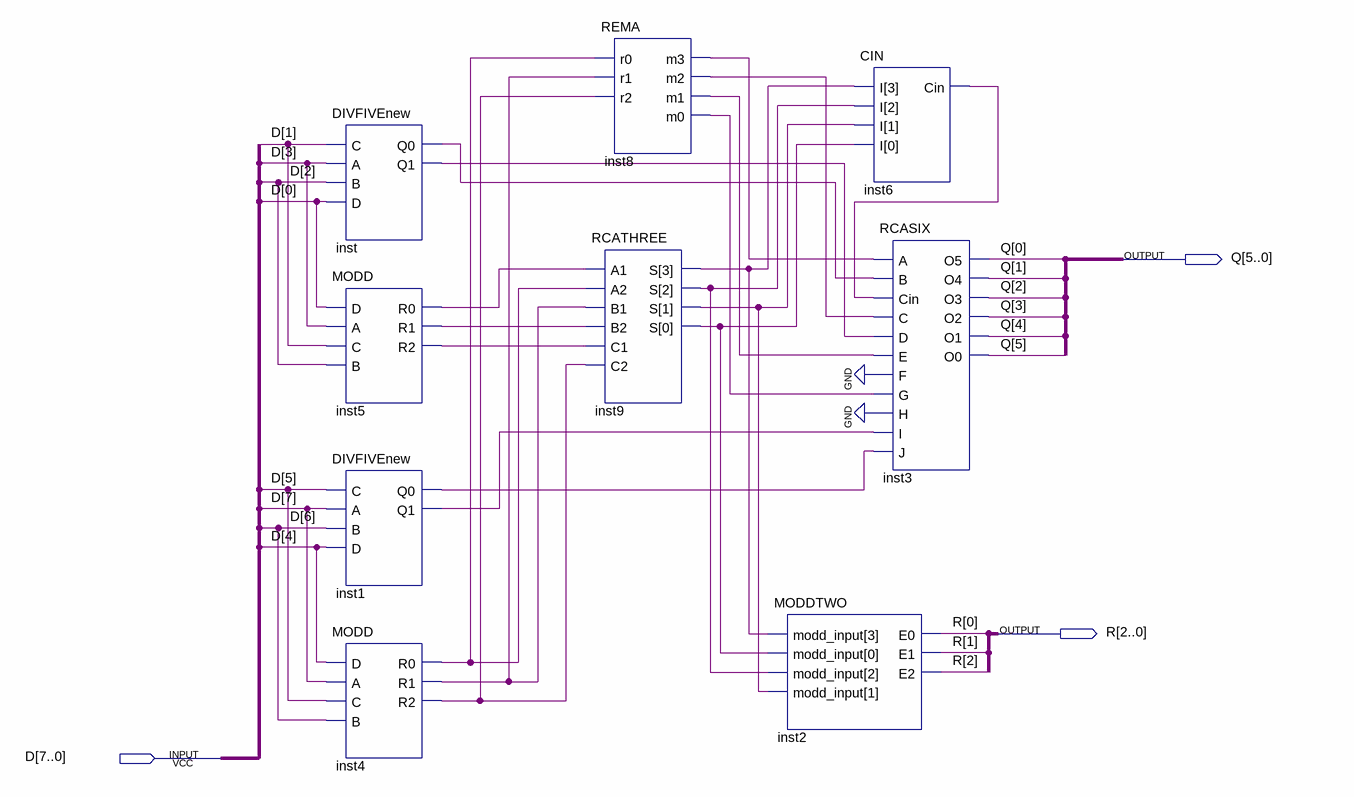
[diagram p0: schematic sheet]
// Quartus schematic EightBitDIV.bdf as structural Verilog: 9 symbols, 3 pins
module EightBitDIV (
  input  [7:0] D,
  output [5:0] Q,
  output [2:0] R
);

  wire inst1_q0, inst1_q1, inst4_r0, inst4_r1, inst4_r2, inst5_r0, inst5_r1, inst5_r2, inst6_cin, inst8_m0,
       inst8_m1, inst8_m2, inst8_m3, inst9_s, inst9_s_2, inst9_s_3, inst9_s_4, inst_q0, inst_q1;

  DIVFIVEnew inst (.C(D[1]), .A(D[3]), .B(D[2]), .D(D[0]), .Q0(inst_q0), .Q1(inst_q1));
  MODD inst5 (.D(D[0]), .A(D[3]), .C(D[1]), .B(D[2]), .R0(inst5_r0), .R1(inst5_r1), .R2(inst5_r2));
  DIVFIVEnew inst1 (.C(D[5]), .A(D[7]), .B(D[6]), .D(D[4]), .Q0(inst1_q0), .Q1(inst1_q1));
  MODD inst4 (.D(D[4]), .A(D[7]), .C(D[5]), .B(D[6]), .R0(inst4_r0), .R1(inst4_r1), .R2(inst4_r2));
  REMA inst8 (.r0(inst4_r0), .r1(inst4_r1), .r2(inst4_r2), .m3(inst8_m3), .m2(inst8_m2), .m1(inst8_m1), .m0(inst8_m0));
  RCATHREE inst9 (
    .A1(inst5_r0), .A2(inst4_r0), .B1(inst4_r1), .B2(inst5_r1), .C1(inst5_r2), .C2(inst4_r2),
    .S({inst9_s, inst9_s_3, inst9_s_4, inst9_s_2}));
  MODDTWO inst2 (.modd_input({inst9_s, inst9_s_3, inst9_s_4, inst9_s_2}), .E0(R[0]), .E1(R[1]), .E2(R[2]));
  CIN inst6 (.I({inst9_s, inst9_s_3, inst9_s_4, inst9_s_2}), .Cin(inst6_cin));
  RCASIX inst3 (
    .A(inst8_m3), .B(inst_q0), .Cin(inst6_cin), .C(inst8_m2), .D(inst_q1), .E(inst8_m1), .F(1'b0),
    .G(inst8_m0), .H(1'b0), .I(inst1_q1), .J(inst1_q0), .O5(Q[0]), .O4(Q[1]), .O3(Q[2]), .O2(Q[3]),
    .O1(Q[4]), .O0(Q[5]));
endmodule
